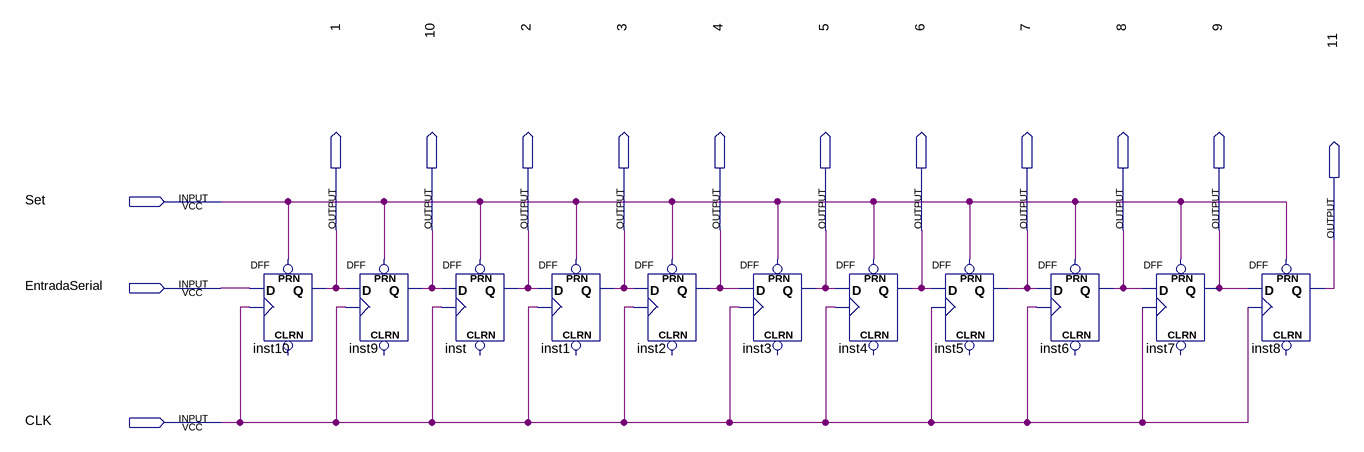
[diagram p0: schematic sheet]
// Quartus schematic SerialPararelo.bdf as structural Verilog: 11 symbols, 14 pins
module SerialPararelo (
  input  Set,
  input  EntradaSerial,
  input  CLK,
  output \1 ,
  output \10 ,
  output \2 ,
  output \3 ,
  output \4 ,
  output \5 ,
  output \6 ,
  output \7 ,
  output \8 ,
  output \9 ,
  output \11 
);

  DFF inst10 (.CLK(CLK), .D(EntradaSerial), .PRN(Set), .Q(\1 ));  // open: CLRN
  DFF inst9 (.CLK(CLK), .D(\1 ), .PRN(Set), .Q(\10 ));  // open: CLRN
  DFF inst (.CLK(CLK), .D(\10 ), .PRN(Set), .Q(\2 ));  // open: CLRN
  DFF inst1 (.CLK(CLK), .D(\2 ), .PRN(Set), .Q(\3 ));  // open: CLRN
  DFF inst2 (.CLK(CLK), .D(\3 ), .PRN(Set), .Q(\4 ));  // open: CLRN
  DFF inst3 (.CLK(CLK), .D(\4 ), .PRN(Set), .Q(\5 ));  // open: CLRN
  DFF inst4 (.CLK(CLK), .D(\5 ), .PRN(Set), .Q(\6 ));  // open: CLRN
  DFF inst5 (.CLK(CLK), .D(\6 ), .PRN(Set), .Q(\7 ));  // open: CLRN
  DFF inst6 (.CLK(CLK), .D(\7 ), .PRN(Set), .Q(\8 ));  // open: CLRN
  DFF inst7 (.CLK(CLK), .D(\8 ), .PRN(Set), .Q(\9 ));  // open: CLRN
  DFF inst8 (.CLK(CLK), .D(\9 ), .PRN(Set), .Q(\11 ));  // open: CLRN
endmodule
